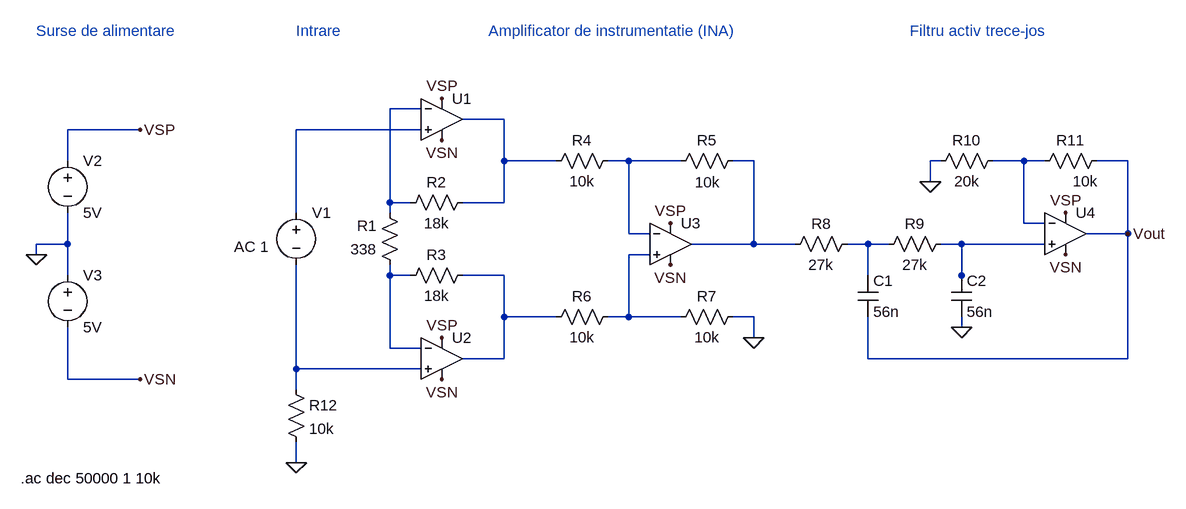
[diagram p0: schematic ACM.asc]
ACM.asc, the LTspice schematic file:
Version 4
SHEET 1 1616 680
WIRE 480 -64 432 -64
WIRE 608 -48 544 -48
WIRE 48 -32 -64 -32
WIRE 480 -32 288 -32
WIRE -64 16 -64 -32
WIRE 608 16 608 -48
WIRE 688 16 608 16
WIRE 800 16 768 16
WIRE 880 16 800 16
WIRE 992 16 960 16
WIRE 1280 16 1264 16
WIRE 1408 16 1360 16
WIRE 1440 16 1408 16
WIRE 1568 16 1520 16
WIRE 1264 48 1264 16
WIRE 432 80 432 -64
WIRE 464 80 432 80
WIRE 608 80 608 16
WIRE 608 80 544 80
WIRE 288 96 288 -32
WIRE 432 96 432 80
WIRE 1408 112 1408 16
WIRE 1440 112 1408 112
WIRE 800 128 800 16
WIRE 832 128 800 128
WIRE 1568 128 1568 16
WIRE 1568 128 1504 128
WIRE -64 144 -64 96
WIRE -64 144 -112 144
WIRE 992 144 992 16
WIRE 992 144 896 144
WIRE 1056 144 992 144
WIRE 1168 144 1136 144
WIRE 1200 144 1168 144
WIRE 1312 144 1280 144
WIRE 1440 144 1312 144
WIRE -112 160 -112 144
WIRE 832 160 800 160
WIRE -64 192 -64 144
WIRE 432 192 432 176
WIRE 464 192 432 192
WIRE 608 192 544 192
WIRE 1168 192 1168 144
WIRE 1312 192 1312 144
WIRE 1312 208 1312 192
WIRE 608 256 608 192
WIRE 688 256 608 256
WIRE 800 256 800 160
WIRE 800 256 768 256
WIRE 880 256 800 256
WIRE 992 256 960 256
WIRE 1312 272 1312 256
WIRE 992 288 992 256
WIRE 432 304 432 192
WIRE 480 304 432 304
WIRE 608 320 608 256
WIRE 608 320 544 320
WIRE 1168 320 1168 256
WIRE 1568 320 1568 128
WIRE 1568 320 1168 320
WIRE 288 336 288 176
WIRE 480 336 288 336
WIRE -64 352 -64 272
WIRE 48 352 -64 352
WIRE 288 368 288 336
WIRE 288 480 288 448
FLAG 992 288 0
FLAG 1312 272 0
FLAG 1264 48 0
FLAG 288 480 0
FLAG 48 -32 VSP
FLAG 48 352 VSN
FLAG 512 -80 VSP
FLAG 864 112 VSP
FLAG 512 288 VSP
FLAG 1472 96 VSP
FLAG 512 352 VSN
FLAG 512 -16 VSN
FLAG 864 176 VSN
FLAG 1472 160 VSN
FLAG 1568 128 Vout
FLAG -112 160 0
SYMBOL voltage -64 0 R0
WINDOW 123 0 0 Left 2
WINDOW 39 0 0 Left 2
SYMATTR InstName V2
SYMATTR Value 5V
SYMBOL voltage -64 176 R0
WINDOW 123 0 0 Left 2
WINDOW 39 0 0 Left 2
SYMATTR InstName V3
SYMATTR Value 5V
SYMBOL voltage 288 80 R0
WINDOW 3 24 44 Left 2
WINDOW 123 -96 68 Left 2
WINDOW 39 0 0 Left 2
SYMATTR Value ""
SYMATTR Value2 AC 1
SYMATTR InstName V1
SYMBOL Opamps\\UniversalOpamp2 512 -48 R0
SYMATTR InstName U1
SYMBOL Opamps\\UniversalOpamp2 512 320 R0
SYMATTR InstName U2
SYMBOL res 448 208 R270
WINDOW 0 32 56 VTop 2
WINDOW 3 0 56 VBottom 2
SYMATTR InstName R3
SYMATTR Value 18k
SYMBOL res 448 96 R270
WINDOW 0 32 56 VTop 2
WINDOW 3 0 56 VBottom 2
SYMATTR InstName R2
SYMATTR Value 18k
SYMBOL res 272 352 R0
SYMATTR InstName R12
SYMATTR Value 10k
SYMBOL Opamps\\UniversalOpamp2 864 144 R0
SYMATTR InstName U3
SYMBOL res 448 192 R180
WINDOW 0 36 76 Left 2
WINDOW 3 36 40 Left 2
SYMATTR InstName R1
SYMATTR Value 338
SYMBOL res 784 0 R90
WINDOW 0 0 56 VBottom 2
WINDOW 3 32 56 VTop 2
SYMATTR InstName R4
SYMATTR Value 10k
SYMBOL res 784 240 R90
WINDOW 0 0 56 VBottom 2
WINDOW 3 32 56 VTop 2
SYMATTR InstName R6
SYMATTR Value 10k
SYMBOL res 864 272 R270
WINDOW 0 32 56 VTop 2
WINDOW 3 0 56 VBottom 2
SYMATTR InstName R7
SYMATTR Value 10k
SYMBOL res 976 0 R90
WINDOW 0 0 56 VBottom 2
WINDOW 3 33 55 VTop 2
SYMATTR InstName R5
SYMATTR Value 10k
SYMBOL res 1152 128 R90
WINDOW 0 0 56 VBottom 2
WINDOW 3 32 56 VTop 2
SYMATTR InstName R8
SYMATTR Value 27k
SYMBOL cap 1152 192 R0
SYMATTR InstName C1
SYMATTR Value 56n
SYMBOL res 1296 128 R90
WINDOW 0 0 56 VBottom 2
WINDOW 3 32 56 VTop 2
SYMATTR InstName R9
SYMATTR Value 27k
SYMBOL cap 1296 192 R0
SYMATTR InstName C2
SYMATTR Value 56n
SYMBOL Opamps\\UniversalOpamp2 1472 128 R0
SYMATTR InstName U4
SYMBOL res 1376 0 R90
WINDOW 0 0 56 VBottom 2
WINDOW 3 32 56 VTop 2
SYMATTR InstName R10
SYMATTR Value 20k
SYMBOL res 1536 0 R90
WINDOW 0 0 56 VBottom 2
WINDOW 3 32 33 VTop 2
SYMATTR InstName R11
SYMATTR Value 10k
TEXT -112 -184 Left 2 ;Surse de alimentare
TEXT 288 -184 Left 2 ;Intrare
TEXT 584 -184 Left 2 ;Amplificator de instrumentatie (INA)
TEXT 1232 -184 Left 2 ;Filtru activ trece-jos
TEXT -136 504 Left 2 !.ac dec 50000 1 10k

The netlist it stands for:
* ACM.asc
V2 VSP 0 5V
V3 0 VSN 5V
V1 N003 N012 AC 1
XU1 N003 N001 VSP VSN N002 level.2 Avol=1Meg GBW=10Meg Slew=10Meg ilimit=25m rail=0 Vos=0 phimargin=45 en=0 enk=0 in=0 ink=0 Rin=500Meg  ; pins IN+ IN- V+ V- OUT
XU2 N012 N010 VSP VSN N011 level.2 Avol=1Meg GBW=10Meg Slew=10Meg ilimit=25m rail=0 Vos=0 phimargin=45 en=0 enk=0 in=0 ink=0 Rin=500Meg  ; pins IN+ IN- V+ V- OUT
R3 N010 N011 18k
R2 N001 N002 18k
R12 N012 0 10k
XU3 N009 N004 VSP VSN N005 level.2 Avol=1Meg GBW=10Meg Slew=10Meg ilimit=25m rail=0 Vos=0 phimargin=45 en=0 enk=0 in=0 ink=0 Rin=500Meg  ; pins IN+ IN- V+ V- OUT
R1 N010 N001 338
R4 N004 N002 10k
R6 N009 N011 10k
R7 N009 0 10k
R5 N005 N004 10k
R8 N007 N005 27k
C1 N007 Vout 56n
R9 N008 N007 27k
C2 N008 0 56n
XU4 N008 N006 VSP VSN Vout level.2 Avol=1Meg GBW=10Meg Slew=10Meg ilimit=25m rail=0 Vos=0 phimargin=45 en=0 enk=0 in=0 ink=0 Rin=500Meg  ; pins IN+ IN- V+ V- OUT
R10 N006 0 20k
R11 Vout N006 10k
* Surse de alimentare
* Intrare
* Amplificator de instrumentatie (INA)
* Filtru activ trece-jos
.ac dec 50000 1 10k
.lib UniversalOpamps2.sub
.backanno
.end